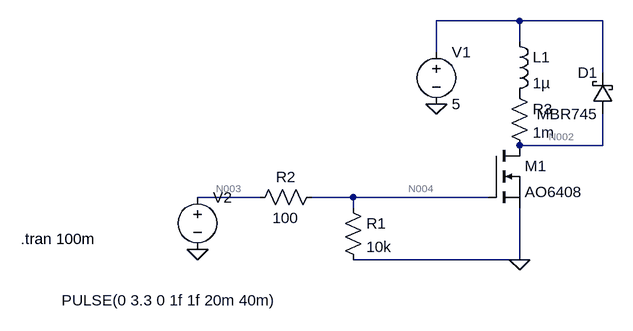
[diagram p0: schematic DC_Motor.asc]
DC_Motor.asc, the LTspice schematic file:
Version 4
SHEET 1 880 680
WIRE 256 -80 128 -80
WIRE 384 -80 256 -80
WIRE 256 -48 256 -80
WIRE 128 -32 128 -80
WIRE 384 0 384 -80
WIRE 384 112 384 64
WIRE 384 112 256 112
WIRE -144 192 -240 192
WIRE 0 192 -64 192
WIRE 208 192 0 192
WIRE 0 208 0 192
WIRE 256 288 256 208
WIRE 256 288 0 288
FLAG 256 288 0
FLAG 128 48 0
FLAG -240 272 0
SYMBOL nmos 208 112 R0
SYMATTR InstName M1
SYMATTR Value AO6408
SYMBOL voltage 128 -48 R0
WINDOW 123 0 0 Left 0
WINDOW 39 0 0 Left 0
SYMATTR InstName V1
SYMATTR Value 5
SYMBOL res -16 192 R0
SYMATTR InstName R1
SYMATTR Value 10k
SYMBOL res -48 176 R90
WINDOW 0 0 56 VBottom 2
WINDOW 3 32 56 VTop 2
SYMATTR InstName R2
SYMATTR Value 100
SYMBOL voltage -240 176 R0
WINDOW 3 -209 175 Left 2
WINDOW 123 0 0 Left 0
WINDOW 39 0 0 Left 0
SYMATTR InstName V2
SYMATTR Value PULSE(0 3.3 0 1f 1f 20m 40m)
SYMBOL ind 240 -64 R0
SYMATTR InstName L1
SYMATTR Value 1µ
SYMBOL res 240 16 R0
SYMATTR InstName R3
SYMATTR Value 1m
SYMBOL schottky 400 64 R180
WINDOW 0 24 64 Left 2
WINDOW 3 24 0 Left 2
SYMATTR InstName D1
SYMATTR Value MBR745
SYMATTR Description Diode
SYMATTR Type diode
TEXT -512 256 Left 2 !.tran 100m

The netlist it stands for:
* DC_Motor.asc
M1 N002 N004 0 0 AO6408
V1 N001 0 5
R1 N004 0 10k
R2 N004 N003 100
V2 N003 0 PULSE(0 3.3 0 1f 1f 20m 40m)
L1 N001 P001 1µ
R3 P001 N002 1m
D1 N002 N001 MBR745
.model D D
.lib standard.dio
.model NMOS NMOS
.model PMOS PMOS
.lib standard.mos
.tran 100m
.backanno
.end

* Results of the author's LTspice run, read from the files saved beside the schematic
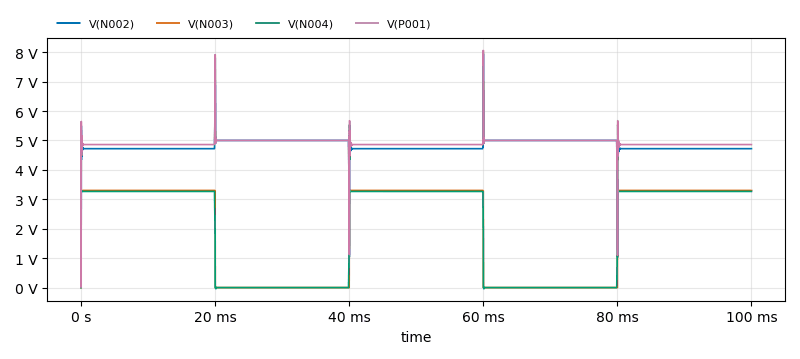
[diagram p1: Transient Analysis of DC_Motor.asc, plotted from the saved traces]
* Transient Analysis, 1 run:
*   V(N002): min 14.43 mV, max 7.944 V, average 4.83 V, rms 4.834 V, last 4.72 V
*   V(N003): min 0 V, max 3.3 V, average 1.98 V, rms 2.556 V, last 3.3 V
*   V(N004): min -41.21 mV, max 3.309 V, average 1.961 V, rms 2.53 V, last 3.267 V
*   V(P001): min 15.02 mV, max 8.061 V, average 4.914 V, rms 4.917 V, last 4.86 V